# EAGLE schematic zumo_tb_03 (EAGLE 9.6.2)

## Sheet 1 of 2
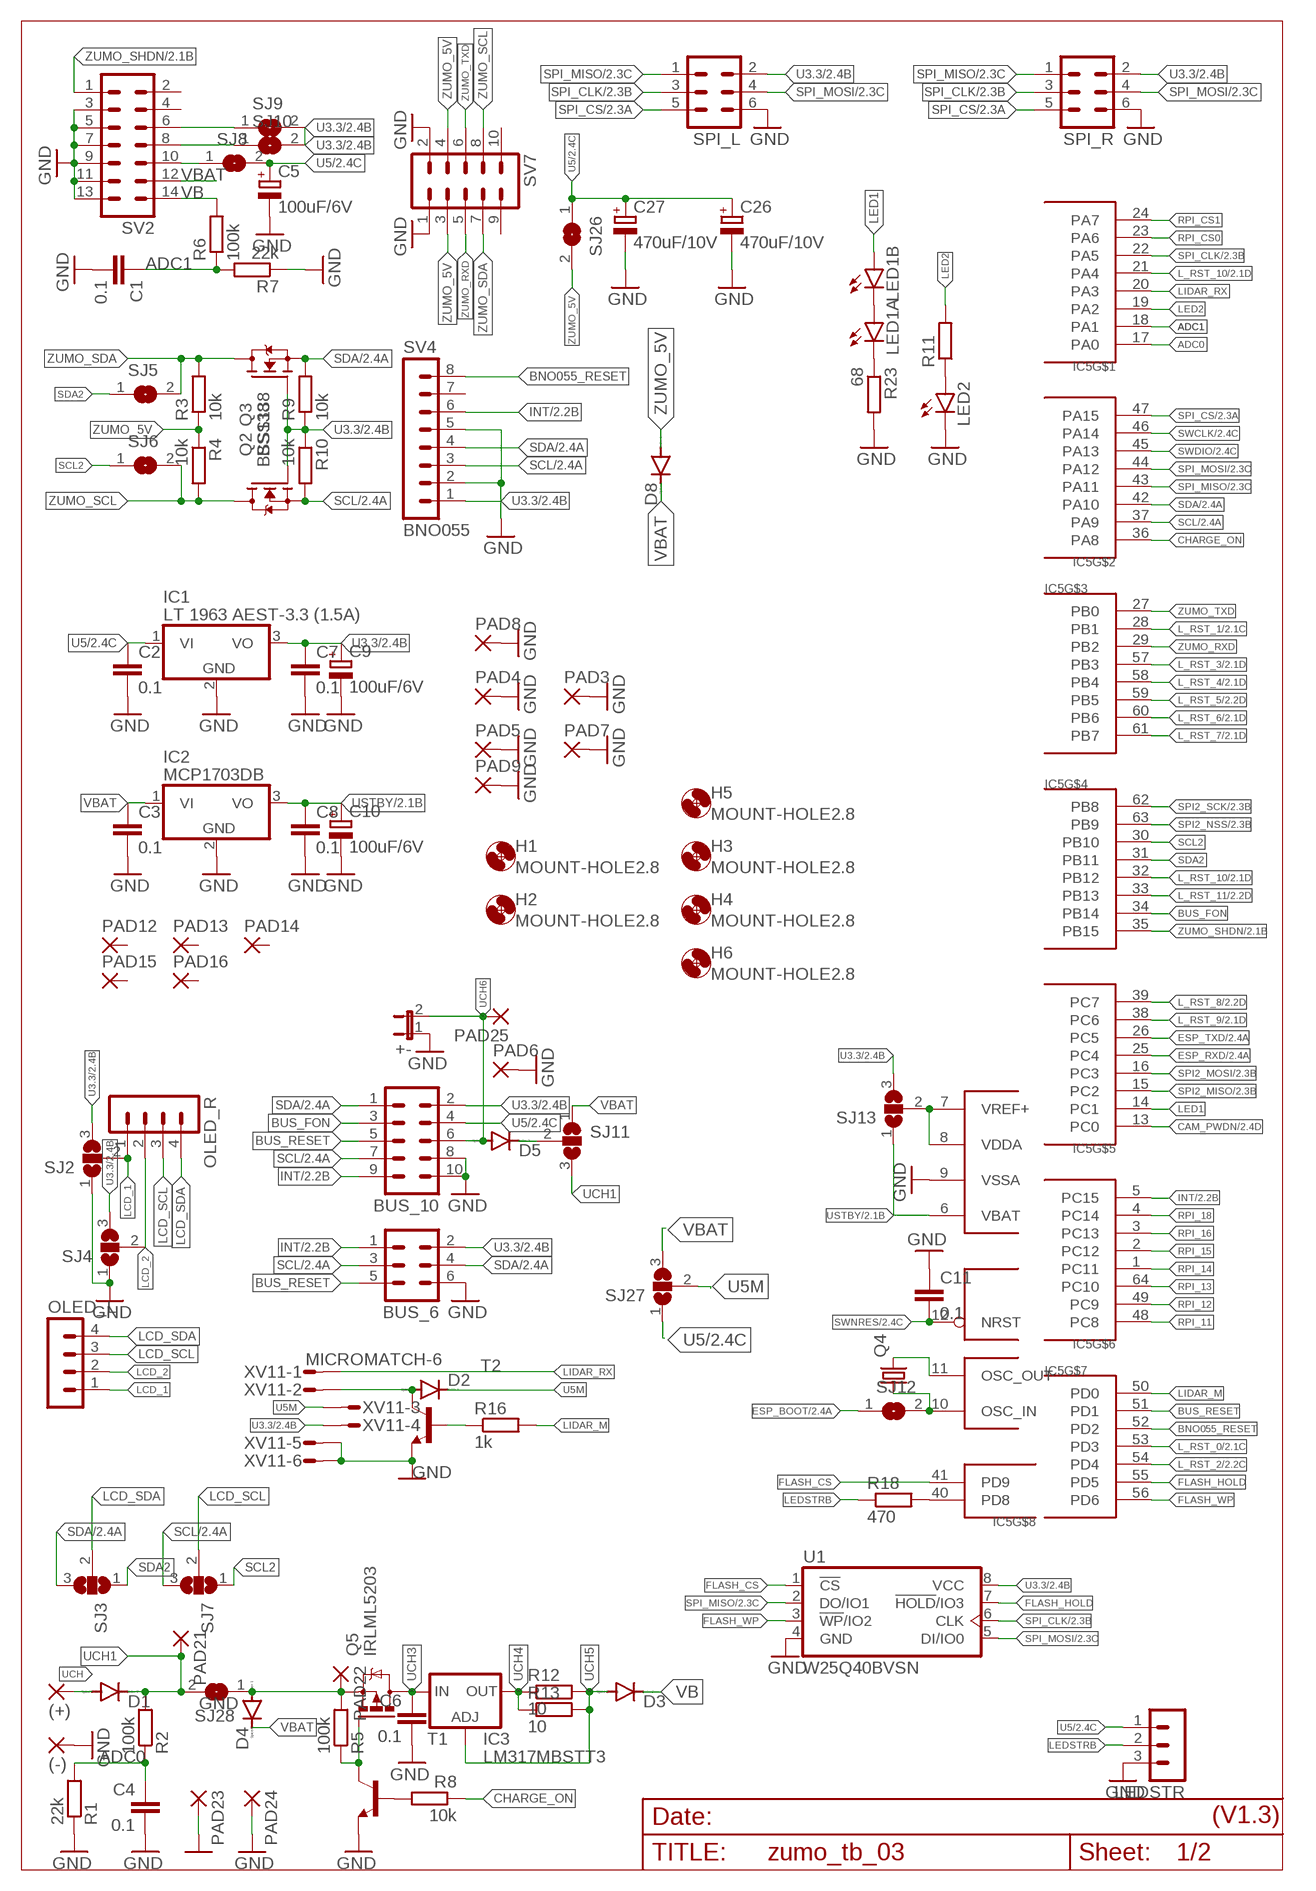
[diagram p0: schematic, sheet 1]

### Parts
(+)  3,81/1,4  [3,81/1,4]
(-)  3,81/1,4  [3,81/1,4]
+-  JP1E  [JP1]
BUS_6  ML6  [ML6]
BUS_10  ML10  [ML10]
C1  0.1  C-EUC0805  [C0805]
C2  0.1  C-EUC0805  [C0805]
C3  0.1  C-EUC0805  [C0805]
C4  0.1  C-EUC0805  [C0805]
C5  100uF/6V  CPOL-EUB/3528-21R  [B/3528-21R]
C6  0.1  C-EUC0805  [C0805]
C7  0.1  C-EUC0805  [C0805]
C8  0.1  C-EUC0805  [C0805]
C9  100uF/6V  CPOL-EUB/3528-21R  [B/3528-21R]
C10  100uF/6V  CPOL-EUB/3528-21R  [B/3528-21R]
C11  0.1  C-EUC0805  [C0805]
C26  470uF/10V  CPOL-EUSMCD  [SMC_D]
C27  470uF/10V  CPOL-EUSMCD  [SMC_D]
D1  DIODE-MELF-MLL41  [MELF-MLL41]
D2  DIODE-MINIMELF  [MINIMELF]
D3  DIODE-MELF-MLL41  [MELF-MLL41]
D4  DIODE-MELF-MLL41  [MELF-MLL41]
D5  DIODE-MELF-MLL41  [MELF-MLL41]
D8  DIODE-MELF-MLL41  [MELF-MLL41]
H1  MOUNT-HOLE2.8  [2,8]
H2  MOUNT-HOLE2.8  [2,8]
H3  MOUNT-HOLE2.8  [2,8]
H4  MOUNT-HOLE2.8  [2,8]
H5  MOUNT-HOLE2.8  [2,8]
H6  MOUNT-HOLE2.8  [2,8]
IC1  LT 1963 AEST-3.3 (1.5A)  MCP1703DB  [SOT223]
IC2  MCP1703DB  [SOT223]
IC3  LM317MBSTT3  [SOT223]
IC5  STM32G081RBT6  [TQFP64]
LED1A  LED5MM  [LED5MM]
LED1B  LED5MM  [LED5MM]
LED2  LEDCHIPLED_0805  [CHIPLED_0805]
LEDSTR  MA03-1  [MA03-1]
OLED_L  MA04-1  [MA04-1]
OLED_R  MA04-1  [MA04-1]
PAD3  3,81/1,4  [3,81/1,4]
PAD4  2,15/1,0  [2,15/1,0]
PAD5  2,15/1,0  [2,15/1,0]
PAD6  2,15/1,0  [2,15/1,0]
PAD7  3,81/1,4  [3,81/1,4]
PAD8  2,15/1,0  [2,15/1,0]
PAD9  3,81/1,4  [3,81/1,4]
PAD12  1,6/0,9  [1,6/0,9]
PAD13  1,6/0,9  [1,6/0,9]
PAD14  1,6/0,9  [1,6/0,9]
PAD15  1,6/0,9  [1,6/0,9]
PAD16  1,6/0,9  [1,6/0,9]
PAD21  1,6/0,8  [1,6/0,8]
PAD22  1,6/0,8  [1,6/0,8]
PAD23  1,6/0,8  [1,6/0,8]
PAD24  1,6/0,8  [1,6/0,8]
PAD25  1,6/0,9  [1,6/0,9]
Q2  BSS138  [SOT23]
Q3  BSS138  [SOT23]
Q4  CRYSTALTC26V  [TC26V]
Q5  IRLML5203  [MICRO3]
R1  22k  R-EU_R0805  [R0805]
R2  100k  R-EU_R0805  [R0805]
R3  10k  R-EU_R0805  [R0805]
R4  10k  R-EU_R0805  [R0805]
R5  100k  R-EU_R0805  [R0805]
R6  100k  R-EU_R0805  [R0805]
R7  22k  R-EU_R0805  [R0805]
R8  10k  R-EU_R0805  [R0805]
R9  10k  R-EU_R0805  [R0805]
R10  10k  R-EU_R0805  [R0805]
R11  R-EU_R0603  [R0603]
R12  10  R-EU_R2010  [R2010]
R13  10  R-EU_R2010  [R2010]
R16  1k  R-EU_R0805  [R0805]
R18  470  R-EU_R0805  [R0805]
R23  68  R-EU_R0805  [R0805]
SJ2  SJ2W  [SJ_2]
SJ3  SJ2W  [SJ_2]
SJ4  SJ2W  [SJ_2]
SJ5  SJ  [SJ]
SJ6  SJ  [SJ]
SJ7  SJ2W  [SJ_2]
SJ8  SJ  [SJ]
SJ9  SJ  [SJ]
SJ10  SJ  [SJ]
SJ11  SJ2W  [SJ_2]
SJ12  SJ  [SJ]
SJ13  SJ2W  [SJ_2]
SJ26  SJ  [SJ]
SJ27  SJ2W  [SJ_2]
SJ28  SJ  [SJ]
SPI_L  ML6  [ML6]
SPI_R  ML6  [ML6]
SV2  MA07-2  [MA07-2]
SV4  BNO055  MA08-1  [MA08-1]
SV7  MA05-2  [MA05-2]
T1  BC817-16-NPN-SOT23-BEC  [SOT23-BEC]
T2  BC817-16-NPN-SOT23-BEC  [SOT23-BEC]
U1  W25Q40BVSN  [SO08]
XV11  MICROMATCH-6  [MICROMATCH-6]

### Nets
ADC0: C4.1 IC5.17(PA0) R1.2 R2.1
ADC1: C1.1 IC5.18(PA1) R6.1 R7.2
BNO055_RESET: IC5.52(PD2) SV4.8
BUS_FON: BUS_10.3 IC5.34(PB14)
BUS_RESET: BUS_6.5 BUS_10.5 IC5.51(PD1)
CAM_PWDN: IC5.13(PC0) ; also sheet 2
CHARGE_ON: IC5.36(PA8) R8.1
ESP_BOOT: SJ12.1 ; also sheet 2
ESP_RXD: IC5.25(PC4) ; also sheet 2
ESP_TXD: IC5.26(PC5) ; also sheet 2
FLASH_CS: IC5.41(PD9) U1.1(!CS!)
FLASH_HOLD: IC5.55(PD5) U1.7(!HOLD!/IO3)
FLASH_WP: IC5.56(PD6) U1.3(!WP!/IO2)
GND [gnd]: (-).1(P) +-.1 BUS_6.6 BUS_10.8 BUS_10.10 C1.2 C2.2 C3.2 C4.2 C5.- C6.2 C7.2 C8.2 C9.- C10.- C11.1 C26.- C27.- IC1.2(GND) IC2.2(GND) IC5.9(VSSA) LED2.C LEDSTR.3 PAD3.1(P) PAD4.1(P) PAD5.1(P) PAD6.1(P) PAD7.1(P) PAD8.1(P) PAD9.1(P) PAD23.1(P) PAD24.1(P) R1.1 R7.1 R23.2 SJ2.1 SJ4.1 SPI_L.6 SPI_R.6 SV2.3 SV2.5 SV2.7 SV2.9 SV2.11 SV2.13 SV4.2 SV4.5 SV7.1 SV7.2 T1.E T2.E U1.4(GND) XV11.5 XV11.6 ; also sheet 2
INT: BUS_6.1 BUS_10.9 IC5.5(PC15) SV4.6 ; also sheet 2
L_RST_0: IC5.53(PD3) ; also sheet 2
L_RST_1: IC5.28(PB1) ; also sheet 2
L_RST_2: IC5.54(PD4) ; also sheet 2
L_RST_3: IC5.57(PB3) ; also sheet 2
L_RST_4: IC5.58(PB4) ; also sheet 2
L_RST_5: IC5.59(PB5) ; also sheet 2
L_RST_6: IC5.60(PB6) ; also sheet 2
L_RST_7: IC5.61(PB7) ; also sheet 2
L_RST_8: IC5.39(PC7) ; also sheet 2
L_RST_9: IC5.38(PC6) ; also sheet 2
L_RST_10: IC5.21(PA4) IC5.32(PB12) ; also sheet 2
L_RST_11: IC5.33(PB13) ; also sheet 2
LCD_1 [power]: OLED_L.1 OLED_R.1 SJ2.2
LCD_2 [power]: OLED_L.2 OLED_R.2 SJ4.2
LCD_SCL: OLED_L.3 OLED_R.3 SJ7.2
LCD_SDA: OLED_L.4 OLED_R.4 SJ3.2
LED1: IC5.14(PC1) LED1B.A
LED2: IC5.19(PA2) R11.2
LEDSTRB: LEDSTR.2 R18.1
LIDAR_M: IC5.50(PD0) R16.2
LIDAR_RX: IC5.20(PA3) XV11.1
N$2: IC5.11(OSC_OUT) Q4.2
N$3: IC5.10(OSC_IN) Q4.1 SJ12.2
N$4: IC5.40(PD8) R18.2
N$5 [power]: IC5.7(VREF+) IC5.8(VDDA) SJ13.2
N$6: LED2.A R11.1
N$8 [power]: SJ10.1 SV2.8
N$9 [power]: SJ9.1 SV2.6
N$15: Q5.1(G) R5.1 T1.C
N$16: R8.2 T1.B
N$25: R16.1 T2.B
N$39 [power]: D5.C SJ11.2
N$42: LED1A.A LED1B.K(C)
N$43: LED1A.K(C) R23.1
N$44: D2.A T2.C XV11.2
RPI_11: IC5.48(PC8) ; also sheet 2
RPI_12: IC5.49(PC9) ; also sheet 2
RPI_13: IC5.64(PC10) ; also sheet 2
RPI_14: IC5.1(PC11) ; also sheet 2
RPI_15: IC5.2(PC12) ; also sheet 2
RPI_16: IC5.3(PC13) ; also sheet 2
RPI_18: IC5.4(PC14) ; also sheet 2
RPI_CS0: IC5.23(PA6) ; also sheet 2
RPI_CS1: IC5.24(PA7) ; also sheet 2
SCL: BUS_6.3 BUS_10.7 IC5.37(PA9) Q3.2(S) R10.2 SJ7.3 SV4.3 ; also sheet 2
SCL2: IC5.30(PB10) SJ6.1 SJ7.1
SDA: BUS_6.4 BUS_10.1 IC5.42(PA10) Q2.2(S) R9.2 SJ3.3 SV4.4 ; also sheet 2
SDA2: IC5.31(PB11) SJ3.1 SJ5.1
SPI2_MISO: IC5.15(PC2) ; also sheet 2
SPI2_MOSI: IC5.16(PC3) ; also sheet 2
SPI2_NSS: IC5.63(PB9) ; also sheet 2
SPI2_SCK: IC5.62(PB8) ; also sheet 2
SPI_CLK: IC5.22(PA5) SPI_L.3 SPI_R.3 U1.6(CLK) ; also sheet 2
SPI_CS: IC5.47(PA15) SPI_L.5 SPI_R.5 ; also sheet 2
SPI_MISO: IC5.43(PA11) SPI_L.1 SPI_R.1 U1.2(DO/IO1) ; also sheet 2
SPI_MOSI: IC5.44(PA12) SPI_L.4 SPI_R.4 U1.5(DI/IO0) ; also sheet 2
SWCLK: IC5.46(PA14) ; also sheet 2
SWDIO: IC5.45(PA13) ; also sheet 2
SWNRES: C11.2 IC5.12(NRST) ; also sheet 2
U3.3 [power]: BUS_6.2 BUS_10.2 C7.1 C9.+ IC1.3(VO) Q2.1(G) Q3.1(G) R9.1 R10.1 SJ2.3 SJ4.3 SJ9.2 SJ10.2 SJ13.3 SPI_L.2 SPI_R.2 SV4.1 U1.8(VCC) XV11.4 ; also sheet 2
U5 [power]: BUS_10.4 C2.1 C5.+ C26.+ C27.+ IC1.1(VI) LEDSTR.1 SJ8.2 SJ26.1 SJ27.1 ; also sheet 2
U5M [power]: D2.C SJ27.2 XV11.3
UCH [power]: (+).1(P) D1.A
UCH1 [power]: D1.C PAD21.1(P) R2.2 SJ11.3 SJ28.2
UCH2 [power]: D4.A PAD22.1(P) Q5.2(S) R5.2 SJ28.1
UCH3 [power]: C6.1 IC3.3(IN) Q5.3(D)
UCH4 [power]: IC3.4(OUT) R12.1 R13.1
UCH5 [power]: D3.A IC3.1(ADJ) R12.2 R13.2
UCH6 [power]: +-.2 BUS_10.6 D5.A PAD25.1(P)
USTBY: C8.1 C10.+ IC2.3(VO) IC5.6(VBAT) SJ13.1 ; also sheet 2
VB [power]: D3.C R6.2 SV2.14
VBAT [power]: C3.1 D4.C D8.C IC2.1(VI) SJ11.1 SJ27.3 SV2.12
ZUMO_5V: D8.A R3.1 R4.1 SJ26.2 SV7.3 SV7.4
ZUMO_RXD: IC5.29(PB2) SV7.5
ZUMO_SCL: Q3.3(D) R4.2 SJ6.2 SV7.8
ZUMO_SDA: Q2.3(D) R3.2 SJ5.2 SV7.7
ZUMO_SHDN: IC5.35(PB15) SV2.1 ; also sheet 2
ZUMO_TXD: IC5.27(PB0) SV7.6
ZUMO_VREG: SJ8.1 SV2.10
Unconnected: PAD12.1(P) PAD13.1(P) PAD14.1(P) PAD15.1(P) PAD16.1(P) SV2.2 SV2.4 SV4.7 SV7.9 SV7.10

### Notes on the sheet
- (V1.3)

## Sheet 2 of 2
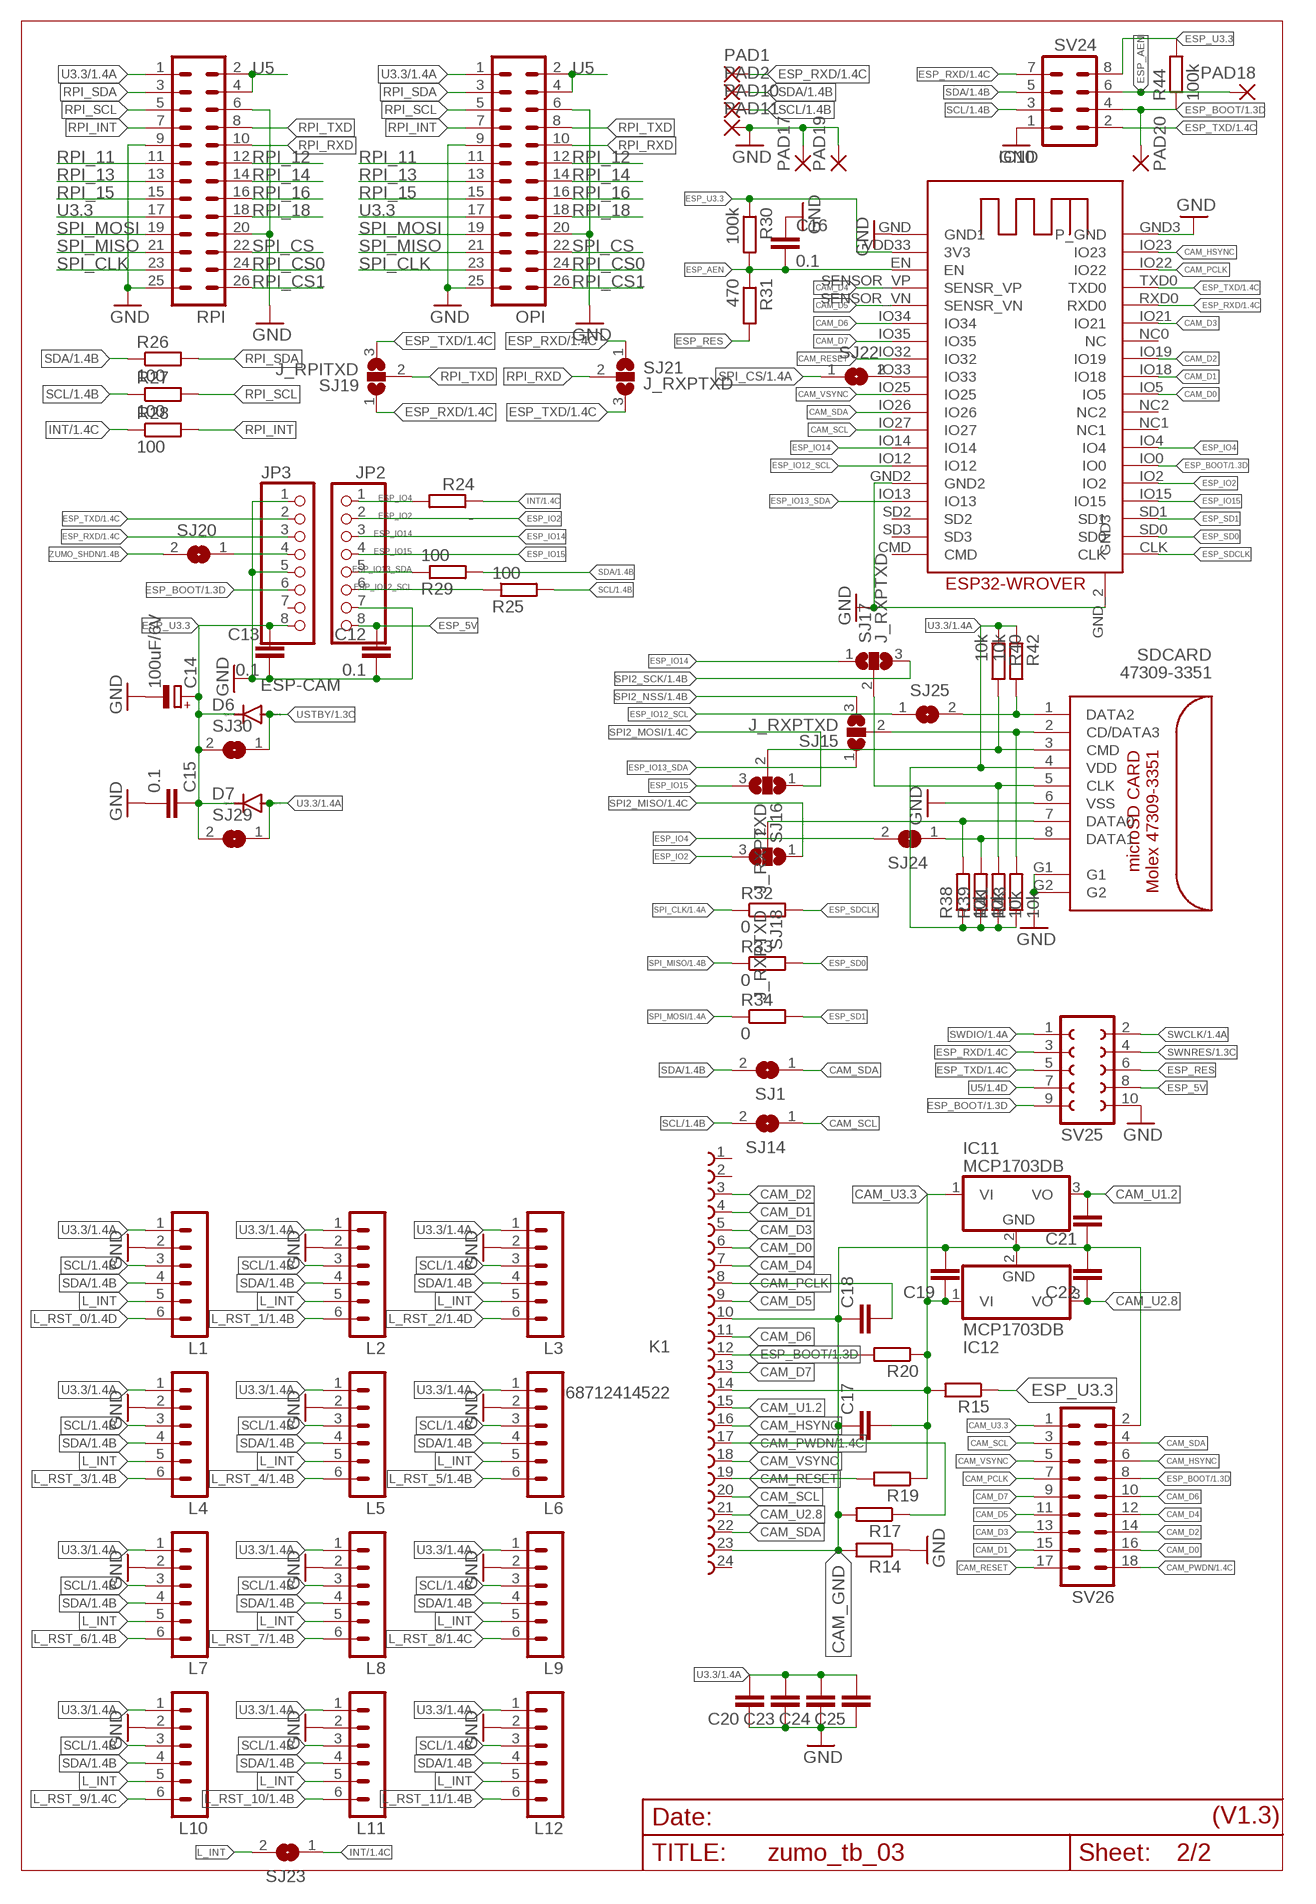
[diagram p1: schematic, sheet 2]

### Parts
C12  0.1  C-EUC0805  [C0805]
C13  0.1  C-EUC0805  [C0805]
C14  100uF/6V  CPOL-EUB/3528-21R  [B/3528-21R]
C15  0.1  C-EUC0805  [C0805]
C16  0.1  C-EUC0805  [C0805]
C17  C-EUC0603  [C0603]
C18  C-EUC0603  [C0603]
C19  C-EUC0603  [C0603]
C20  C-EUC0603  [C0603]
C21  C-EUC0603  [C0603]
C22  C-EUC0603  [C0603]
C23  C-EUC0603  [C0603]
C24  C-EUC0603  [C0603]
C25  C-EUC0603  [C0603]
D6  DIODE-MICROMELF-W  [MICROMELF-W]
D7  DIODE-MICROMELF-W  [MICROMELF-W]
IC10  ESP32-WROVER  [ESP32-WROVER]
IC11  MCP1703DB  [SOT223]
IC12  MCP1703DB  [SOT223]
JP2  PINHD-1X8_2.54-SMD  [1X08SMD]
JP3  PINHD-1X8_2.54-SMD  [1X08SMD]
K1  68712414522  [68712414522]
L1  MA06-1  [MA06-1]
L2  MA06-1  [MA06-1]
L3  MA06-1  [MA06-1]
L4  MA06-1  [MA06-1]
L5  MA06-1  [MA06-1]
L6  MA06-1  [MA06-1]
L7  MA06-1  [MA06-1]
L8  MA06-1  [MA06-1]
L9  MA06-1  [MA06-1]
L10  MA06-1  [MA06-1]
L11  MA06-1  [MA06-1]
L12  MA06-1  [MA06-1]
OPI  MA13-2  [MA13-2]
PAD1  1,6/0,9  [1,6/0,9]
PAD2  1,6/0,9  [1,6/0,9]
PAD10  1,6/0,9  [1,6/0,9]
PAD11  1,6/0,9  [1,6/0,9]
PAD17  1,6/0,9  [1,6/0,9]
PAD18  1,6/0,9  [1,6/0,9]
PAD19  1,6/0,9  [1,6/0,9]
PAD20  1,6/0,9  [1,6/0,9]
R14  R-EU_R0603  [R0603]
R15  R-EU_R0603  [R0603]
R17  R-EU_R0603  [R0603]
R19  R-EU_R0603  [R0603]
R20  R-EU_R0603  [R0603]
R24  -  R-EU_R0805  [R0805]
R25  100  R-EU_R0805  [R0805]
R26  100  R-EU_R0805  [R0805]
R27  100  R-EU_R0805  [R0805]
R28  100  R-EU_R0805  [R0805]
R29  100  R-EU_R0805  [R0805]
R30  100k  R-EU_R0805  [R0805]
R31  470  R-EU_R0805  [R0805]
R32  0  R-EU_R0805  [R0805]
R33  0  R-EU_R0805  [R0805]
R34  0  R-EU_R0805  [R0805]
R38  10k  R-EU_R0805  [R0805]
R39  10k  R-EU_R0805  [R0805]
R40  10k  R-EU_R0805  [R0805]
R41  10k  R-EU_R0805  [R0805]
R42  10k  R-EU_R0805  [R0805]
R43  10k  R-EU_R0805  [R0805]
R44  100k  R-EU_R0805  [R0805]
RPI  MA13-2  [MA13-2]
SDCARD  47309-3351  [47309-3351]
SJ1  SJ  [SJ]
SJ14  SJ  [SJ]
SJ15  J_RXPTXD  SJ2W  [SJ_2]
SJ16  J_RXPTXD  SJ2W  [SJ_2]
SJ17  J_RXPTXD  SJ2W  [SJ_2]
SJ18  J_RXPTXD  SJ2W  [SJ_2]
SJ19  J_RPITXD  SJ2W  [SJ_2]
SJ20  SJ  [SJ]
SJ21  J_RXPTXD  SJ2W  [SJ_2]
SJ22  SJ  [SJ]
SJ23  SJ  [SJ]
SJ24  SJ  [SJ]
SJ25  SJ  [SJ]
SJ29  SJ  [SJ]
SJ30  SJ  [SJ]
SV24  MA04-2  [MA04-2]
SV25  FE05-2  [FE05-2]
SV26  MA09-2  [MA09-2]

### Nets
CAM_D0: IC10.IO5 K1.6 SV26.16
CAM_D1: IC10.IO18 K1.4 SV26.15
CAM_D2: IC10.IO19 K1.3 SV26.14
CAM_D3: IC10.IO21 K1.5 SV26.13
CAM_D4: IC10.SENSOR_VP(SENSR_VP) K1.7 SV26.12
CAM_D5: IC10.SENSOR_VN(SENSR_VN) K1.9 SV26.11
CAM_D6: IC10.IO34 K1.11 SV26.10
CAM_D7: IC10.IO35 K1.13 SV26.9
CAM_GND: C17.1 C18.1 C19.2 C21.1 C22.2 IC11.2(GND) IC12.2(GND) K1.10 K1.23 R14.2 R17.2 SV26.2
CAM_HSYNC: IC10.IO23 K1.16 SV26.6
CAM_PCLK: C18.2 IC10.IO22 K1.8 SV26.7
CAM_PWDN: K1.17 R17.1 SV26.18 ; also sheet 1
CAM_RESET: IC10.IO32 K1.19 R19.2 SV26.17
CAM_SCL: IC10.IO27 K1.20 SJ14.1 SV26.3
CAM_SDA: IC10.IO26 K1.22 SJ1.1 SV26.4
CAM_U1.2: C21.2 IC11.3(VO) K1.15
CAM_U2.8: C22.1 IC12.3(VO) K1.21
CAM_U3.3: C17.2 C19.1 IC11.1(VI) IC12.1(VI) K1.14 R15.2 R19.1 R20.1 SV26.1
CAM_VSYNC: IC10.IO25 K1.18 SV26.5
ESP_5V [power]: C12.1 JP2.8 SV25.8
ESP_AEN: C16.2 IC10.EN PAD18.1(P) R30.2 R31.1 SV24.6
ESP_BOOT: IC10.IO0 JP3.6 K1.12 PAD20.1(P) R20.2 R44.1 SV24.4 SV25.9 SV26.8 ; also sheet 1
ESP_IO2: IC10.IO2 JP2.2 SJ18.3
ESP_IO4: IC10.IO4 JP2.1 R24.2 SJ24.2
ESP_IO12_SCL: IC10.IO12 JP2.6 R25.1 SJ25.1
ESP_IO13_SDA: IC10.IO13 JP2.5 R29.1 SJ15.1
ESP_IO14: IC10.IO14 JP2.3 SJ17.1
ESP_IO15: IC10.IO15 JP2.4 SJ16.3
ESP_RES: R31.2 SV25.6
ESP_RXD: IC10.RXD0 JP3.3 PAD1.1(P) SJ19.1 SJ21.1 SV24.7 SV25.3 ; also sheet 1
ESP_SD0: IC10.SD0 R33.2
ESP_SD1: IC10.SD1 R34.2
ESP_SDCLK: IC10.CLK R32.2
ESP_TXD: IC10.TXD0 JP3.2 SJ19.3 SJ21.3 SV24.2 SV25.5 ; also sheet 1
ESP_U3.3 [power]: C13.1 C14.+ C15.1 D6.C D7.C IC10.VDD33(3V3) JP3.8 R15.1 R30.1 R44.2 SJ29.2 SJ30.2 SV24.8
ESPCAM_13: JP3.4 SJ20.1
GND [gnd]: C12.2 C13.2 C14.- C15.2 C16.1 C20.1 C23.1 C24.1 C25.1 IC10.GND2 IC10.GND3(P_GND) IC10.GND(GND1) IC10.GND_2(GND3) JP2.7 JP3.1 JP3.5 L1.2 L2.2 L3.2 L4.2 L5.2 L6.2 L7.2 L8.2 L9.2 L10.2 L11.2 L12.2 OPI.6 OPI.9 OPI.20 OPI.25 PAD11.1(P) PAD17.1(P) PAD19.1(P) R14.1 RPI.6 RPI.9 RPI.20 RPI.25 SDCARD.6(VSS) SDCARD.G1 SDCARD.G2 SV24.1 SV25.10 ; also sheet 1
INT: R24.1 R28.1 SJ23.1 ; also sheet 1
L_INT: L1.5 L2.5 L3.5 L4.5 L5.5 L6.5 L7.5 L8.5 L9.5 L10.5 L11.5 L12.5 SJ23.2
L_RST_0: L1.6 ; also sheet 1
L_RST_1: L2.6 ; also sheet 1
L_RST_2: L3.6 ; also sheet 1
L_RST_3: L4.6 ; also sheet 1
L_RST_4: L5.6 ; also sheet 1
L_RST_5: L6.6 ; also sheet 1
L_RST_6: L7.6 ; also sheet 1
L_RST_7: L8.6 ; also sheet 1
L_RST_8: L9.6 ; also sheet 1
L_RST_9: L10.6 ; also sheet 1
L_RST_10: L11.6 ; also sheet 1
L_RST_11: L12.6 ; also sheet 1
N$7: IC10.IO33 SJ22.2
RPI_11: OPI.11 RPI.11 ; also sheet 1
RPI_12: OPI.12 RPI.12 ; also sheet 1
RPI_13: OPI.13 RPI.13 ; also sheet 1
RPI_14: OPI.14 RPI.14 ; also sheet 1
RPI_15: OPI.15 RPI.15 ; also sheet 1
RPI_16: OPI.16 RPI.16 ; also sheet 1
RPI_18: OPI.18 RPI.18 ; also sheet 1
RPI_CS0: OPI.24 RPI.24 ; also sheet 1
RPI_CS1: OPI.26 RPI.26 ; also sheet 1
RPI_INT: OPI.7 R28.2 RPI.7
RPI_RXD: OPI.10 RPI.10 SJ21.2
RPI_SCL: OPI.5 R27.2 RPI.5
RPI_SDA: OPI.3 R26.2 RPI.3
RPI_TXD: OPI.8 RPI.8 SJ19.2
SCL: L1.3 L2.3 L3.3 L4.3 L5.3 L6.3 L7.3 L8.3 L9.3 L10.3 L11.3 L12.3 PAD10.1(P) R25.2 R27.1 SJ14.2 SV24.3 ; also sheet 1
SD_CLK: R41.2 SDCARD.5(CLK) SJ17.2
SD_CMD: R40.2 SDCARD.3(CMD) SJ16.2
SD_DAT0: R38.2 SDCARD.7(DATA0) SJ18.2
SD_DAT1: R39.2 SDCARD.8(DATA1) SJ24.1
SD_DAT2: R42.2 SDCARD.1(DATA2) SJ25.2
SD_DAT3: R43.2 SDCARD.2(CD/DATA3) SJ15.2
SDA: L1.4 L2.4 L3.4 L4.4 L5.4 L6.4 L7.4 L8.4 L9.4 L10.4 L11.4 L12.4 PAD2.1(P) R26.1 R29.2 SJ1.2 SV24.5 ; also sheet 1
SPI2_MISO: SJ18.1 ; also sheet 1
SPI2_MOSI: SJ16.1 ; also sheet 1
SPI2_NSS: SJ15.3 ; also sheet 1
SPI2_SCK: SJ17.3 ; also sheet 1
SPI_CLK: OPI.23 R32.1 RPI.23 ; also sheet 1
SPI_CS: OPI.22 RPI.22 SJ22.1 ; also sheet 1
SPI_MISO: OPI.21 R33.1 RPI.21 ; also sheet 1
SPI_MOSI: OPI.19 R34.1 RPI.19 ; also sheet 1
SWCLK: SV25.2 ; also sheet 1
SWDIO: SV25.1 ; also sheet 1
SWNRES: SV25.4 ; also sheet 1
U3.3 [power]: C20.2 C23.2 C24.2 C25.2 D7.A L1.1 L2.1 L3.1 L4.1 L5.1 L6.1 L7.1 L8.1 L9.1 L10.1 L11.1 L12.1 OPI.1 OPI.17 R38.1 R39.1 R40.1 R41.1 R42.1 R43.1 RPI.1 RPI.17 SDCARD.4(VDD) SJ29.1 ; also sheet 1
U5 [power]: OPI.2 OPI.4 RPI.2 RPI.4 SV25.7 ; also sheet 1
USTBY: D6.A SJ30.1 ; also sheet 1
ZUMO_SHDN: SJ20.2 ; also sheet 1
Unconnected: IC10.CMD IC10.NC0(NC) IC10.NC1 IC10.NC2 IC10.SD2 IC10.SD3 JP3.7 K1.1 K1.2 K1.24

### Notes on the sheet
- ESP-CAM
- (V1.3)

## Library data of the parts
(+) (-) PAD3 PAD7 PAD9 = wirepad:3,81/1,4: THROUGH-HOLE PAD
+- = jumper:JP1E: JUMPER
BUS_6 SPI_L SPI_R = con-harting-ml:ML6: HARTING; OC_FARNELL: unknown; OC_NEWARK: unknown
BUS_10 = con-harting-ml:ML10: HARTING; OC_FARNELL: unknown; OC_NEWARK: unknown
C1-C4 C6-C8 C11-C13 C15 C16 = rcl:C-EU: CAPACITOR, European symbol
C5 C9 C10 C14 = rcl:CPOL-EU: POLARIZED CAPACITOR, European symbol
C17-C25 = rcl:C-EU: CAPACITOR, European symbol; SPICEPREFIX: C
C26 C27 = rcl:CPOL-EU: POLARIZED CAPACITOR, European symbol; SPICEPREFIX: C
D1-D8 = diode:DIODE-: DIODE
H1-H6 = holes:MOUNT-HOLE: MOUNTING HOLE with drill center marker
IC1 IC2 IC11 IC12 = linear:MCP1703: 250 mA, 16V, Low Quiescent Current LDO Regulator Source: http://ww1.microchip.com/downloads/en/DeviceDoc/22049b.pdf
IC3 = v-reg:LM317?*: 500 mA Adjustable Output Positive Voltage Regulator Source: http://www.onsemi.co.jp .. LM317M-D.PDF
IC5 = stm32:STM32G081RBT6
IC10 = ESP32-Wrover:ESP32-WROVER
JP2 JP3 = pinhead-1:PINHD-1X8: PIN HEADER
K1 = FPC_Connectors_Flat_Flexible_Cable_rev15c:68712414522: WE-FPC 0.5mm SMT ZIF Horizontal Bottom Contact, 24 Pins=>Code : Con_FPC_ZIF_0.50_68712414522 <http://katalog.we-online.de/media/images/eican/Con_FPC_ZIF_0.50_6871xx14522_pf2.jpg> Details see: http://katalog.we-online.de/en/em/687_1xx_145_22 Created 2014-07-09, Karrer Zheng 2014 (C) Würth Elektronik
L1-L12 = con-lstb:MA06-1: PIN HEADER; OC_FARNELL: unknown; OC_NEWARK: unknown
LED1A LED1B LED2 = led:LED: LED OSRAM: - CHIPLED LG R971, LG N971, LY N971, LG Q971, LY Q971, LO R971, LY R971 LH N974, LH R974 LS Q976, LO Q976, LY Q976 LO Q996 - Hyper CHIPLED LW Q18S LB Q993, LB Q99A, LB R99A - SideLED LS A670, LO A670, LY A670, LG A670, LP A670 LB A673, LV A673, LT A673, LW A673 LH A674 LY A675 LS A676, LA A676, LO A676, LY A676, LW A676 LS A679, LY A679, LG A679 - Hyper Micro SIDELED® LS Y876, LA Y876, LO Y876, LY Y876 LT Y87S - SmartLED LW L88C, LW L88S LB L89C, LB L89S, LG L890 LS L89K, LO L89K, LY L89K LS L896, LA L896, LO L896, LY L896 - TOPLED LS T670, LO T670, LY T670, LG T670, LP T670 LSG T670, LSP T670, LSY T670, LOP T670, LYG T670 LG T671, LOG T671, LSG T671 LB T673, LV T673, LT T673, LW T673 LH T674 LS T676, LA T676, LO T676, LY T676, LB T676, LH T676, LSB T676, LW T676 LB T67C, LV T67C, LT T67C, LS T67K, LO T67K, LY T67K, LW E67C LS E67B, LA E67B, LO E67B, LY E67B, LB E67C, LV E67C, LT E67C LW T67C LS T679, LY T679, LG T679 LS T770, LO T770, LY T770, LG T770, LP T770 LB T773, LV T773, LT T773, LW T773 LH T774 LS E675, LA E675, LY E675, LS T675 LS T776, LA T776, LO T776, LY T776, LB T776 LHGB T686 LT T68C, LB T68C - Hyper Mini TOPLED® LB M676 - Mini TOPLED Santana® LG M470 LS M47K, LO M47K, LY M47K Source: http://www.osram.convergy.de LUXEON: - LUMILED® LXK2-PW12-R00, LXK2-PW12-S00, LXK2-PW14-U00, LXK2-PW14-V00 LXK2-PM12-R00, LXK2-PM12-S00, LXK2-PM14-U00 LXK2-PE12-Q00, LXK2-PE12-R00, LXK2-PE12-S00, LXK2-PE14-T00, LXK2-PE14-U00 LXK2-PB12-K00, LXK2-PB12-L00, LXK2-PB12-M00, LXK2-PB14-N00, LXK2-PB14-P00, LXK2-PB14-Q00 LXK2-PR12-L00, LXK2-PR12-M00, LXK2-PR14-Q00, LXK2-PR14-R00 LXK2-PD12-Q00, LXK2-PD12-R00, LXK2-PD12-S00 LXK2-PH12-R00, LXK2-PH12-S00 LXK2-PL12-P00, LXK2-PL12-Q00, LXK2-PL12-R00 Source: www.luxeon.com KINGBRIGHT: KA-3528ASYC Source: www.kingbright.com
LEDSTR = con-lstb:MA03-1: PIN HEADER; OC_FARNELL: unknown; OC_NEWARK: unknown
OLED_L OLED_R = con-lstb:MA04-1: PIN HEADER; OC_FARNELL: unknown; OC_NEWARK: unknown
OPI RPI = con-lstb:MA13-2: PIN HEADER; OC_FARNELL: unknown; OC_NEWARK: unknown
PAD1 PAD2 PAD10-PAD20 PAD25 = wirepad:1,6/0,9: THROUGH-HOLE PAD
PAD4-PAD6 PAD8 = wirepad:2,15/1,0: THROUGH-HOLE PAD
PAD21-PAD24 = wirepad:1,6/0,8: THROUGH-HOLE PAD
Q2 Q3 = bss138_10:BSS138: BSS138 N-Channel Logic Level Enhancement Mode Field Effect Transistor Source: http://www.fairchildsemi.com/datasheets/BS/BSS138.pdf; MF: Fairchild; MPN: BSS138; OC_FARNELL: 9845330; OC_NEWARK: 67R2009
Q4 = crystal:CRYSTAL: CRYSTAL; OC_FARNELL: unknown; OC_NEWARK: unknown
Q5 = transistor-power:IRLML5203: HEXFET P-Channel Power MOSFET
R1-R10 R16 R18 R23-R34 R38-R44 = rcl:R-EU_: RESISTOR, European symbol
R11-R15 R17 R19 R20 = rcl:R-EU_: RESISTOR, European symbol; SPICEPREFIX: R
SDCARD = con-molex-microsd:47309-3351
SJ1 SJ5 SJ6 SJ8-SJ10 SJ12 SJ14 SJ20 SJ22-SJ26 SJ28-SJ30 = jumper:SJ: SMD solder JUMPER
SJ2-SJ4 SJ7 SJ11 SJ13 SJ15-SJ19 SJ21 SJ27 = jumper:SJ2W: SMD solder JUMPER
SV2 = con-lstb:MA07-2: PIN HEADER; OC_FARNELL: unknown; OC_NEWARK: unknown
SV4 = con-lstb:MA08-1: PIN HEADER; OC_FARNELL: unknown; OC_NEWARK: unknown
SV7 = con-lstb:MA05-2: PIN HEADER; OC_FARNELL: unknown; OC_NEWARK: unknown
SV24 = con-lstb:MA04-2: PIN HEADER; OC_FARNELL: unknown; OC_NEWARK: unknown
SV25 = con-lsta:FE05-2: FEMALE HEADER; OC_FARNELL: unknown; OC_NEWARK: unknown
SV26 = con-lstb:MA09-2: PIN HEADER; OC_FARNELL: unknown; OC_NEWARK: unknown
T1 T2 = transistor:*-NPN-: NPN Transistror BF959 corrected 2008.03.06
U1 = memory-winbond:W25Q40BV: EEPROM 4 Mbit SPI Serial Flash with Dual and Quad SPI
XV11 = con-amp-micromatch:MICROMATCH-6: MicroMaTch 6 7-215464-6 / 0-215464-6 Drawing Number C-215464 DDEController.pdf; MPN: 7-215464-6; OC_FARNELL: 3784630; OC_NEWARK: 19R8125

## Net classes
1 gnd: width 0.381 mm, drill 0.381 mm
2 power: width 0.381 mm, drill 0.381 mm